# EAGLE design stiquito (EAGLE 7.6.0)
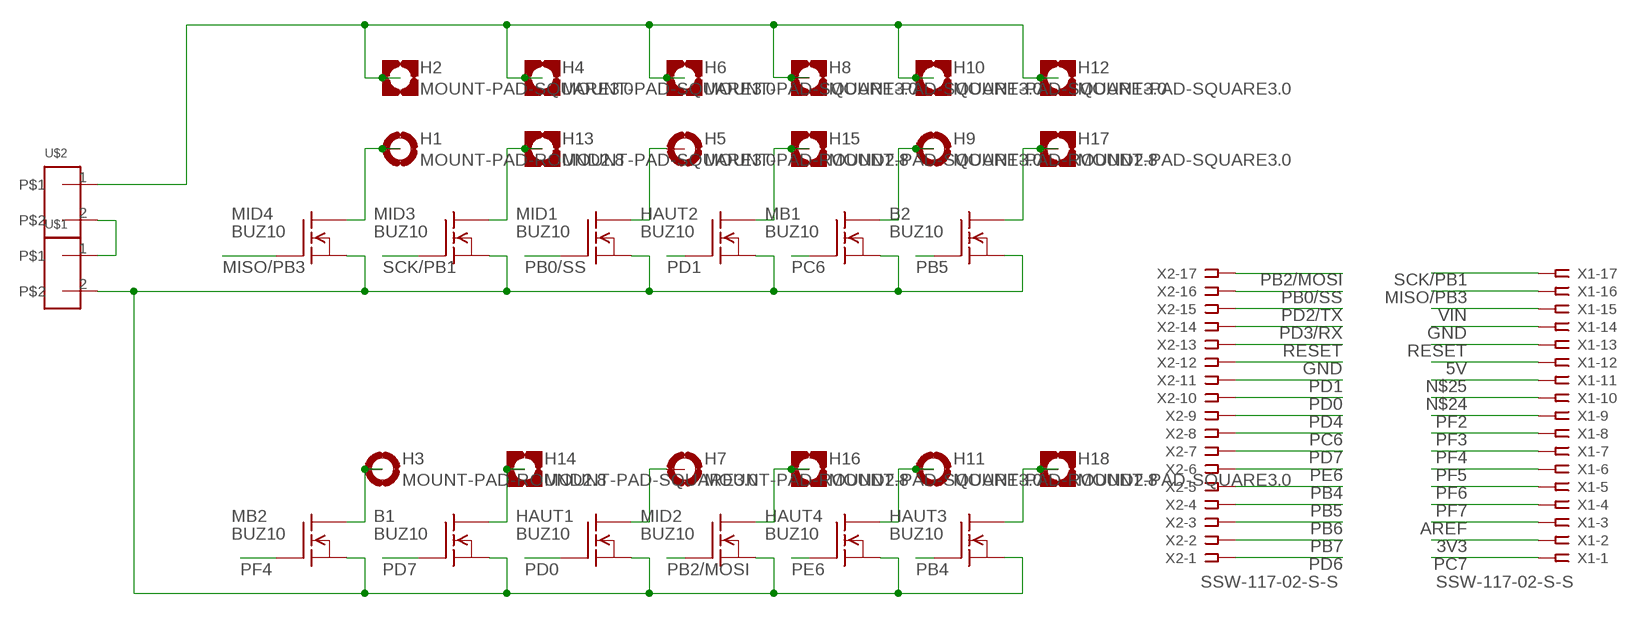
[diagram p0: schematic, sheet 1]

## Parts
B1  BUZ10  [TO220]
B2  BUZ10  [TO220]
H1  MOUNT-PAD-ROUND2.8  [2,8-PAD]
H2  MOUNT-PAD-SQUARE3.0  [3,0-PAD-SQUARE]
H3  MOUNT-PAD-ROUND2.8  [2,8-PAD]
H4  MOUNT-PAD-SQUARE3.0  [3,0-PAD-SQUARE]
H5  MOUNT-PAD-ROUND2.8  [2,8-PAD]
H6  MOUNT-PAD-SQUARE3.0  [3,0-PAD-SQUARE]
H7  MOUNT-PAD-ROUND2.8  [2,8-PAD]
H8  MOUNT-PAD-SQUARE3.0  [3,0-PAD-SQUARE]
H9  MOUNT-PAD-ROUND2.8  [2,8-PAD]
H10  MOUNT-PAD-SQUARE3.0  [3,0-PAD-SQUARE]
H11  MOUNT-PAD-ROUND2.8  [2,8-PAD]
H12  MOUNT-PAD-SQUARE3.0  [3,0-PAD-SQUARE]
H13  MOUNT-PAD-SQUARE3.0  [3,0-PAD-SQUARE]
H14  MOUNT-PAD-SQUARE3.0  [3,0-PAD-SQUARE]
H15  MOUNT-PAD-SQUARE3.0  [3,0-PAD-SQUARE]
H16  MOUNT-PAD-SQUARE3.0  [3,0-PAD-SQUARE]
H17  MOUNT-PAD-SQUARE3.0  [3,0-PAD-SQUARE]
H18  MOUNT-PAD-SQUARE3.0  [3,0-PAD-SQUARE]
HAUT1  BUZ10  [TO220]
HAUT2  BUZ10  [TO220]
HAUT3  BUZ10  [TO220]
HAUT4  BUZ10  [TO220]
MB1  BUZ10  [TO220]
MB2  BUZ10  [TO220]
MID1  BUZ10  [TO220]
MID2  BUZ10  [TO220]
MID3  BUZ10  [TO220]
MID4  BUZ10  [TO220]
U$1  MOLEX_KK_2  [MOLEX_KK_2]
U$2  MOLEX_KK_2  [MOLEX_KK_2]
X1  SSW-117-02-S-S  [SSW-117-02-S-S]
X2  SSW-117-02-S-S  [SSW-117-02-S-S]

## Nets
3V3: X1.2
5V: X1.12
AREF: X1.3
GND: B1.3(S) B2.3(S) HAUT1.3(S) HAUT2.3(S) HAUT3.3(S) HAUT4.3(S) MB1.3(S) MB2.3(S) MID1.3(S) MID2.3(S) MID3.3(S) MID4.3(S) U$1.2 X1.14 X2.12
MISO/PB3: MID4.1(G) X1.16
N$1: U$1.1 U$2.2
N$2: H1.B2,8(MOUNT) MID4.2(D)
N$3: H13.B3,0(MOUNT) MID3.2(D)
N$4: B2.2(D) H17.B3,0(MOUNT)
N$5: H9.B2,8(MOUNT) MB1.2(D)
N$6: H15.B3,0(MOUNT) HAUT2.2(D)
N$7: H5.B2,8(MOUNT) MID1.2(D)
N$8: H18.B3,0(MOUNT) HAUT3.2(D)
N$9: H11.B2,8(MOUNT) HAUT4.2(D)
N$10: H16.B3,0(MOUNT) MID2.2(D)
N$11: H7.B2,8(MOUNT) HAUT1.2(D)
N$12: B1.2(D) H14.B3,0(MOUNT)
N$13: H3.B2,8(MOUNT) MB2.2(D)
N$24: X1.10
N$25: X1.11
PB0/SS: MID1.1(G) X2.16
PB2/MOSI: MID2.1(G) X2.17
PB4: HAUT3.1(G) X2.5
PB5: B2.1(G) X2.4
PB6: X2.3
PB7: X2.2
PC6: MB1.1(G) X2.8
PC7: X1.1
PD0: HAUT1.1(G) X2.10
PD1: HAUT2.1(G) X2.11
PD2/TX: X2.15
PD3/RX: X2.14
PD4: X2.9
PD6: X2.1
PD7: B1.1(G) X2.7
PE6: HAUT4.1(G) X2.6
PF2: X1.9
PF3: X1.8
PF4: MB2.1(G) X1.7
PF5: X1.6
PF6: X1.5
PF7: X1.4
RESET: X1.13 X2.13
SCK/PB1: MID3.1(G) X1.17
VIN: H2.B3,0(MOUNT) H4.B3,0(MOUNT) H6.B3,0(MOUNT) H8.B3,0(MOUNT) H10.B3,0(MOUNT) H12.B3,0(MOUNT) U$2.1 X1.15

## Library data of the parts
B1 B2 HAUT1-HAUT4 MB1 MB2 MID1-MID4 = transistor-fet:BUZ10: N-Channel Enhancement MOSFET 50V; 20A; 0,080Ohm
H1 H3 H5 H7 H9 H11 = holes:MOUNT-PAD-ROUND: MOUNTING PAD, round
H2 H4 H6 H8 H10 H12-H18 = holes:MOUNT-PAD-SQUARE: MOUNTING PAD, square
U$1 U$2 = @Club_connectique:MOLEX_KK_2: Connecteur type Molex KK Références fabricant : - femelle : 22-42-4022-02 - mâle : 22-29-2021-02 Références fournisseur (Farnell) : - femelle : 1602632 <http://fr.farnell.com/molex/22-42-4022/connecteur-idt-2-54mm-24awg-2-voies/dp/1602632> - mâle : 1360130 <http://fr.farnell.com/molex/22-29-2021/embase-male-kk-droite-2-voies/dp/1360130?crosssellid=1360130&crosssell=true&in_merch=true&>
X1 X2 = con-samtec:SSW-117-02-S-S: THROUGH-HOLE .025" SQ POST SOCKET Source: Samtec SSW.pdf; MPN: SSW-117-02-S-S; OC_FARNELL: unknown; OC_NEWARK: 11P9592

## Board
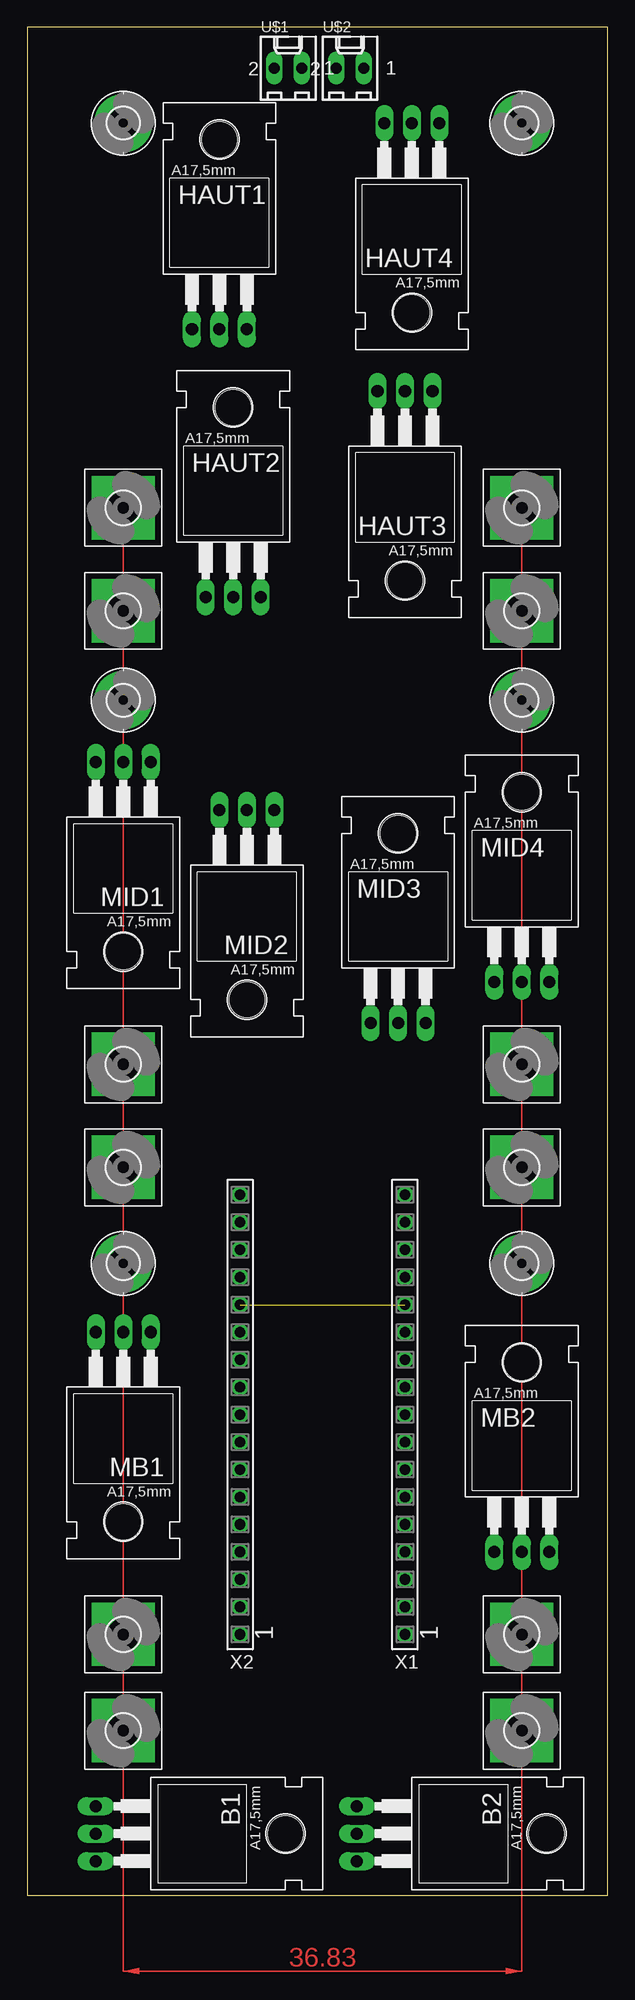
[diagram p1: board, top side]
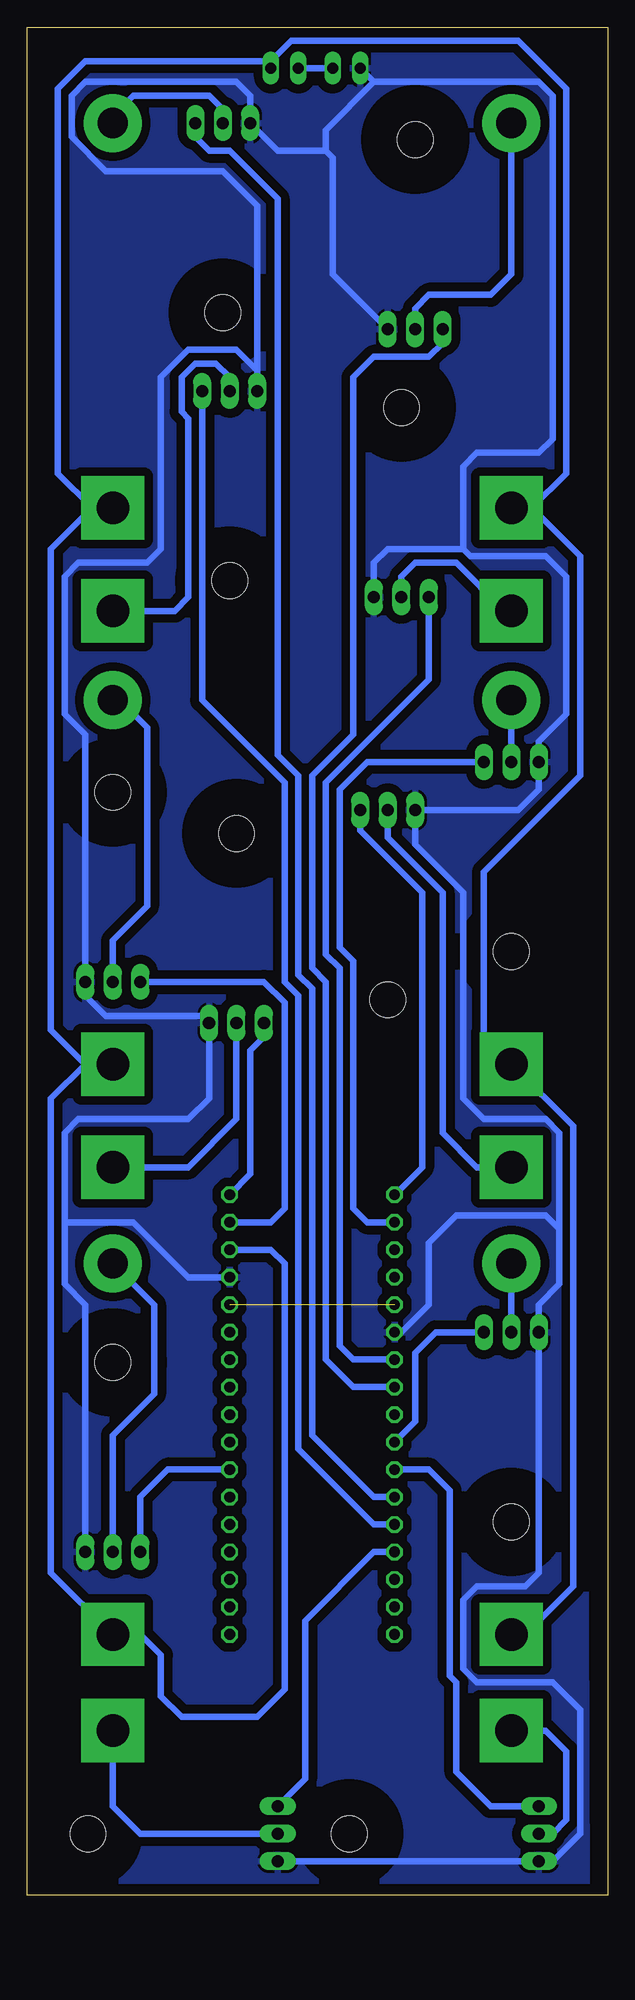
[diagram p2: board, bottom side, seen from below]

Size 53.65 x 172.71 mm. Coordinates in mm from the lower left corner, seen from the top.
Outline: 0,0 53.65,0 53.65,172.71 0,172.71 0,0
Copper layers (1*16): Top 0.035mm / dielectric 1.5mm / Bottom 0.035mm
Design rules "default": minimum track width 10mil, minimum drill 24mil, track to track 8mil, track to pad 8mil, pad to pad 8mil, via to via 8mil, smd to smd 8mil, copper to edge 40mil, drill to drill 8mil, minimum pad ring 10mil, minimum via ring 8mil, stop-mask expansion 4mil, vias tented up to drill 0mil, thermal gap 10mil

### Footprints (pad centres in the part's own frame; a part is rotated, then mirrored left to right if it is on the bottom)
TO220 = drill 1.118 long: 1 -2.54,-6.35; 2 0,-6.35; 3 2.54,-6.35 | hole 3.302: 0,11.176
2,8-PAD = drill 2.8 pad 5.334: B2,8 0,0
3,0-PAD-SQUARE = drill 3 pad 5.842 square: B3,0 0,0
MOLEX_KK_2 = drill 1.016 long: 1 1.27,0; 2 -1.27,0
SSW-117-02-S-S = drill 1 pad 1.5 octagon: 1 -20.32,0; 2 -17.78,0; 3 -15.24,0; 4 -12.7,0; 5 -10.16,0; 6 -7.62,0; 7 -5.08,0; 8 -2.54,0; 9 0,0; 10 2.54,0; 11 5.08,0; 12 7.62,0; 13 10.16,0; 14 12.7,0; 15 15.24,0; 16 17.78,0; 17 20.32,0

### Placement (x,y rotation side)
B1  12.7,5.71 270 top
B2  36.83,5.71 270 top
H1  45.72,110.49 0 top
H2  8.89,24.13 0 top
H3  45.72,58.42 0 top
H4  45.72,76.83 0 top
H5  8.89,110.49 0 top
H6  45.72,128.27 0 top
H7  8.89,163.83 0 top
H8  8.89,76.83 0 top
H9  8.89,58.42 0 top
H10  45.72,24.13 0 top
H11  45.72,163.83 0 top
H12  8.89,128.27 0 top
H13  45.72,67.31 0 top
H14  8.89,15.24 0 top
H15  8.89,118.75 0 top
H16  8.89,67.31 0 top
H17  45.72,15.24 0 top
H18  45.72,118.75 0 top
HAUT1  17.78,151.13 0 top
HAUT2  19.05,126.36 0 top
HAUT3  34.93,132.72 180 top
HAUT4  35.56,157.48 180 top
MB1  8.89,45.72 180 top
MB2  45.72,38.1 0 top
MID1  8.89,98.42 180 top
MID2  20.32,93.98 180 top
MID3  34.29,87 0 top
MID4  45.72,90.81 0 top
U$1  24.13,168.91 0 top
U$2  29.84,168.91 0 top
X1  34.93,44.45 90 top
X2  19.68,44.45 90 top

### Tracks (layer width: path | path; a pad name or v marks a point on that pad's centre or on a via)
GND
  Bottom 0.61: HAUT1.3 25.4,149.86 25.4,160.66 26.04,161.29 | 26.04,161.29 30.48,161.29 HAUT4.3 33.02,166.37 34.29,167.64 48.26,167.64 49.53,166.37 49.53,162.56 46.36,159.38 35.56,159.38 32.38,156.21 32.38,140.97 | HAUT2.3 21.59,123.19 20.32,124.46 13.33,124.46 | HAUT3.3 32.38,140.97 | 13.33,124.46 12.7,123.83 5.71,123.83 3.81,121.92 3.81,109.22 6.35,106.68 MID1.3 6.35,102.23 8.26,100.33 MID2.3 17.78,97.16 13.33,92.71 13.33,73.66 11.43,71.75 5.71,71.75 4.45,70.48 4.45,61.59 | 32.38,140.97 34.29,142.88 38.74,142.88 41.28,140.34 41.28,124.46 42.55,123.19 48.9,123.19 50.17,121.92 50.17,109.22 48.26,107.31 MID4.3 48.26,83.19 46.36,81.28 37.47,81.28 MID3.3 36.83,73.66 38.74,71.75 48.9,71.75 50.17,70.48 50.17,62.23 | 50.17,62.23 50.17,56.52 48.26,54.61 MB2.3 | 4.45,61.59 4.45,56.52 6.35,54.61 MB1.3 6.35,29.84 7.62,28.57 12.06,28.57 13.33,27.3 13.33,20.95 12.06,19.68 5.08,19.68 2.54,17.14 2.54,5.71 5.08,3.17 B1.3 B2.3 | X1.14 38.74,57.15 43.82,62.23 50.17,62.23 | X2.12 19.05,52.07 16.51,54.61 16.51,60.33 13.97,62.87 5.71,62.87 4.45,61.59 | 13.33,124.46 13.33,132.08 12.06,133.35 6.35,133.35 5.08,134.62 5.08,166.37 6.35,167.64 21.59,167.64 | 21.59,167.64 U$1.2 | 21.59,167.64 26.04,163.19 26.04,161.29
  pour Bottom (isolate 0.813): 1.91,0 52.07,0 52.71,172.09 2.54,172.09
MISO/PB3
  Bottom 0.61: MID4.1 31.75,84.45 29.84,82.55 29.84,63.5 31.11,62.23 X1.16
N$1
  Bottom 0.61: U$2.2 U$1.1
N$2
  Bottom 0.61: H1.B2,8 45.09,110.49 42.55,107.95 42.55,91.44 45.72,88.27 MID4.2
N$3
  Bottom 0.61: H13.B3,0 38.74,67.31 34.29,71.75 MID3.2
N$4
  Bottom 0.61: H17.B3,0 45.72,8.26 43.18,5.71 B2.2
N$5
  Bottom 0.61: H9.B2,8 MB1.2
N$6
  Bottom 0.61: HAUT2.2 19.05,121.92 17.78,123.19 13.97,123.19 9.53,118.75 H15.B3,0
N$7
  Bottom 0.61: MID1.2 H5.B2,8
N$8
  Bottom 0.61: HAUT3.2 34.93,140.34 36.2,141.6 38.1,141.6 39.37,140.34 39.37,137.16 38.74,136.53 38.74,120.02 40.01,118.75 H18.B3,0
N$9
  Bottom 0.61: HAUT4.2 35.56,165.1 36.83,166.37 43.82,166.37 45.72,164.47 H11.B2,8
N$10
  Bottom 0.61: MID2.2 20.32,97.79 15.24,92.71 15.24,70.48 12.06,67.31 H16.B3,0 8.26,67.31
N$11
  Bottom 0.61: H7.B2,8 8.89,149.86 10.79,147.96 16.51,147.96 17.78,146.69 HAUT1.2
N$12
  Bottom 0.61: B1.2 5.08,5.71 3.81,6.99 3.81,13.34 5.71,15.24 H14.B3,0
N$13
  Bottom 0.61: H3.B2,8 41.91,54.61 41.91,46.35 45.72,42.55 MB2.2
PB0/SS
  Bottom 0.61: MID1.1 22.22,104.78 24.77,102.23 24.77,87.63 23.5,86.36 23.5,63.5 22.22,62.23 X2.16
PB2/MOSI
  Bottom 0.61: MID2.1 22.86,98.42 17.14,92.71 17.14,67.31 X2.17
PB4
  Bottom 0.61: HAUT3.1 37.47,110.49 29.84,102.87 29.84,84.45 28.57,83.19 28.57,41.27 21.59,34.29 X2.5
PB5
  Bottom 0.61: X2.4 21.59,31.75 27.94,25.4 27.94,10.79 B2.1
PC6
  Bottom 0.61: MB1.1 15.88,52.07 17.78,50.16 17.78,43.81 X2.8
PD0
  Bottom 0.61: X2.10 23.5,46.99 26.04,49.53 26.04,84.45 27.3,85.72 27.3,103.5 23.5,107.31 23.5,140.34 21.59,142.24 16.51,142.24 15.24,143.51 HAUT1.1
PD1
  Bottom 0.61: HAUT2.1 16.51,112.39 26.04,102.87 26.04,87 24.77,85.72 24.77,50.8 23.5,49.53 X2.11
PD7
  Bottom 0.61: B1.1 10.79,8.26 13.97,11.43 13.97,19.68 14.61,20.32 14.61,37.47 16.51,39.37 X2.7
PE6
  Bottom 0.61: HAUT4.1 38.1,162.56 36.83,161.29 34.93,161.29 30.48,156.84 30.48,105.41 28.57,103.5 28.57,85.09 27.3,83.82 27.3,42.55 21.59,36.83 X2.6
PF4
  Bottom 0.61: X1.7 40.64,39.37 43.18,36.83 MB2.1
RESET  (1 unrouted)
SCK/PB1
  Bottom 0.61: MID3.1 31.75,79.38 33.02,78.11 33.02,66.67 X1.17
VIN
  Bottom 0.61: 6.98,128.27 3.81,131.44 3.81,167 8.26,171.45 29.21,171.45 31.11,169.54 U$2.1 31.75,169.54 48.26,169.54 50.8,167 50.8,131.44 47.62,128.27 | 6.98,128.27 H12.B3,0 | H6.B3,0 47.62,128.27 | 47.62,128.27 51.44,124.46 51.44,80.01 48.26,76.83 | 48.26,76.83 H4.B3,0 | 6.98,128.27 2.54,123.83 2.54,103.5 11.43,94.61 11.43,79.38 H8.B3,0 3.17,71.12 3.17,28.57 7.62,24.13 H2.B3,0 | 48.26,76.83 51.44,73.66 51.44,29.84 H10.B3,0 43.18,24.13 41.28,22.23 41.28,18.41 39.37,16.51 32.38,16.51 29.84,19.05 29.84,58.42 31.11,59.69 X1.15
(copper drawn outside any net)
  shapes: Top area x1